# Altium project Testbench__PCB.PrjPcb
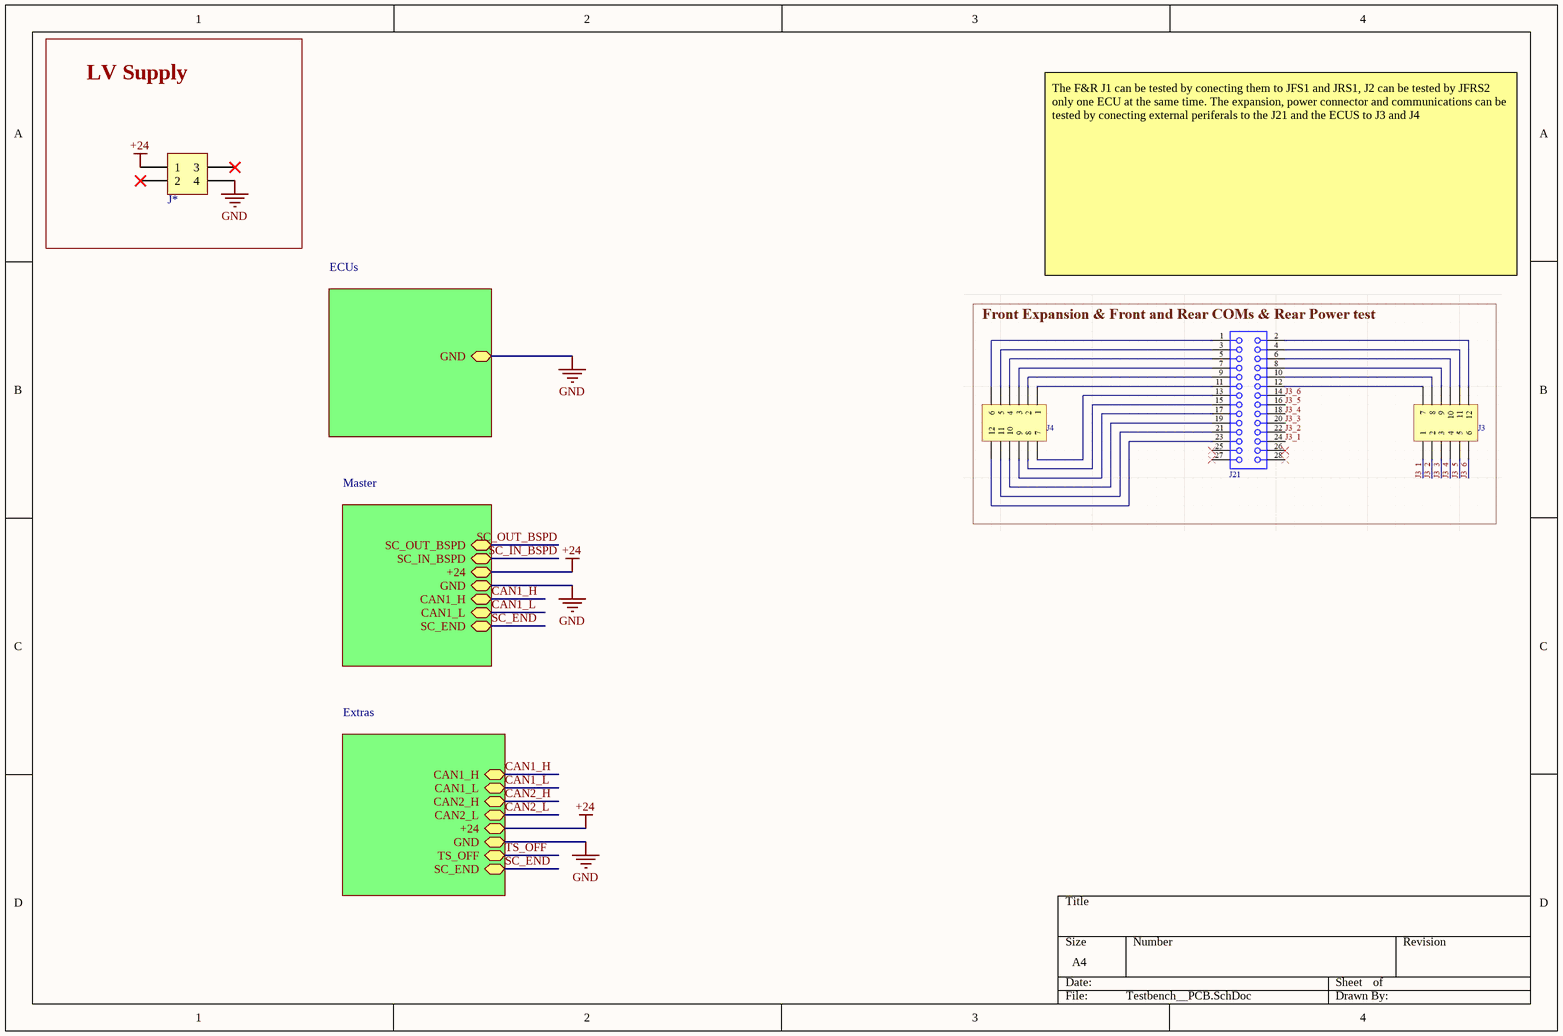
[diagram p0: Testbench__PCB.SchDoc]
5 sheets, 62 parts. Net scope: hierarchical (ports join the sheet entries above them; power ports are global).
Sheets:
  Testbench__PCB.SchDoc
    ECUs = ECUs.SchDoc
    Master = Master.SchDoc
    Extras = Extras.SchDoc
  TS.SchDoc

## Sheet Testbench__PCB.SchDoc
size A4; SheetNumber: 1; SheetTotal: 5

### Parts
(Parts that share a designator on the sheet are numbered #1, #2 ... from top to bottom, then left to right.)
J*#1  430450412  [J_MicroFit_2x2_v]  (value not drawn)

### Blocks framed on the sheet
LV Supply: J*#1

### Sub-sheets
ECUs = ECUs: GND (bidir)
Extras = Extras: CAN1_H (bidir), CAN1_L (bidir), CAN2_H (bidir), CAN2_L (bidir), +24 (bidir), GND (bidir), TS_OFF (bidir), SC_END (bidir)
Master = Master: SC_OUT_BSPD (bidir), SC_IN_BSPD (bidir), +24 (bidir), GND (bidir), CAN1_H (bidir), CAN1_L (bidir), SC_END (bidir)

### Nets
+24: J*#1.1 ; sheet Master/+24, sheet Extras/+24
GND: J*#1.4 ; sheet ECUs/GND, sheet Master/GND, sheet Extras/GND
CAN1_H: sheet Master/CAN1_H, sheet Extras/CAN1_H
CAN1_L: sheet Master/CAN1_L, sheet Extras/CAN1_L
SC_END: sheet Master/SC_END, sheet Extras/SC_END

Not connected (* = marked no-connect by the designer): J*#1 2* 3*

### Notes on the sheet
- The F&R J1 can be tested by conecting them to JFS1 and JRS1, J2 can be tested by JFRS2 only one ECU at the same time. The expansion, power connector and communications can be tested by conecting external periferals to the J21 and the ECUS to J3 and J4

### Library data of the parts
J*#1 = J_MicroFit_2x2: Header 2 Row Vertical Polarizing Peg 4 Pin Tin Plate SMT/Glow Wire Kinked Leads; Manufacturer 1: Molex; Manufacturer Part Number 1: 43045-0412; .Creator: DR; Supplier 1: Arrow Electronics; RoHS: Yes; Category: Headers and Wire Housings; Stock 1: 54122; Pricing 1: 1=1,24720, 10=1,02970, 80=0,85390, 2232=0,63810, 6696=0,59030, 11160=0,55550 (USD); ComponentLink1URL: https://datasheet.ciiva.com/19462/883368-19462265.pdf?src-supplier=Jameco; ComponentLink1Description: https://datasheet.ciiva.com/19462/883368-19462265.pdf?src-supplier=Jameco; ComponentLink2URL: https://datasheet.ciiva.com/5158/0430450412-pcb-headers-142874-5158187.pdf?src-supplier=Mouser; ComponentLink2Description: https://datasheet.ciiva.com/5158/0430450412-pcb-headers-142874-5158187.pdf?src-supplier=Mouser; ComponentLink3URL: https://datasheet.ciiva.com/30095/176640430450412-pcb-headers-30095929.pdf?src-supplier=Onlinecomponents.com; ComponentLink3Description: https://datasheet.ciiva.com/30095/176640430450412-pcb-headers-30095929.pdf?src-supplier=Onlinecomponents.com; ComponentLink4URL: https://datasheet.ciiva.com/11747/0900766b800bd7d2-11747137.pdf?src-supplier=RSComponents; ComponentLink4Description: https://datasheet.ciiva.com/11747/0900766b800bd7d2-11747137.pdf?src-supplier=RSComponents; ComponentLink5URL: https://datasheet.ciiva.com/26916/getdatasheetpartid-253008-26916516.pdf?src-supplier=Verical; ComponentLink5Description: https://datasheet.ciiva.com/26916/getdatasheetpartid-253008-26916516.pdf?src-supplier=Verical; ComponentLink6URL: https://datasheet.ciiva.com/22637/1928349-22637530.pdf?src-supplier=Element14; ComponentLink6Description: https://datasheet.ciiva.com/22637/1928349-22637530.pdf?src-supplier=Element14; ComponentLink7URL: https://datasheet.ciiva.com/9468/0430450412-pcb-headers-9468485.pdf?src-supplier=Avnet; ComponentLink7Description: https://datasheet.ciiva.com/9468/0430450412-pcb-headers-9468485.pdf?src-supplier=Avnet; Supplier Part Number 1: 43045-0412

## Sheet ECUs.SchDoc
size A4; SheetNumber: 2; SheetTotal: 5
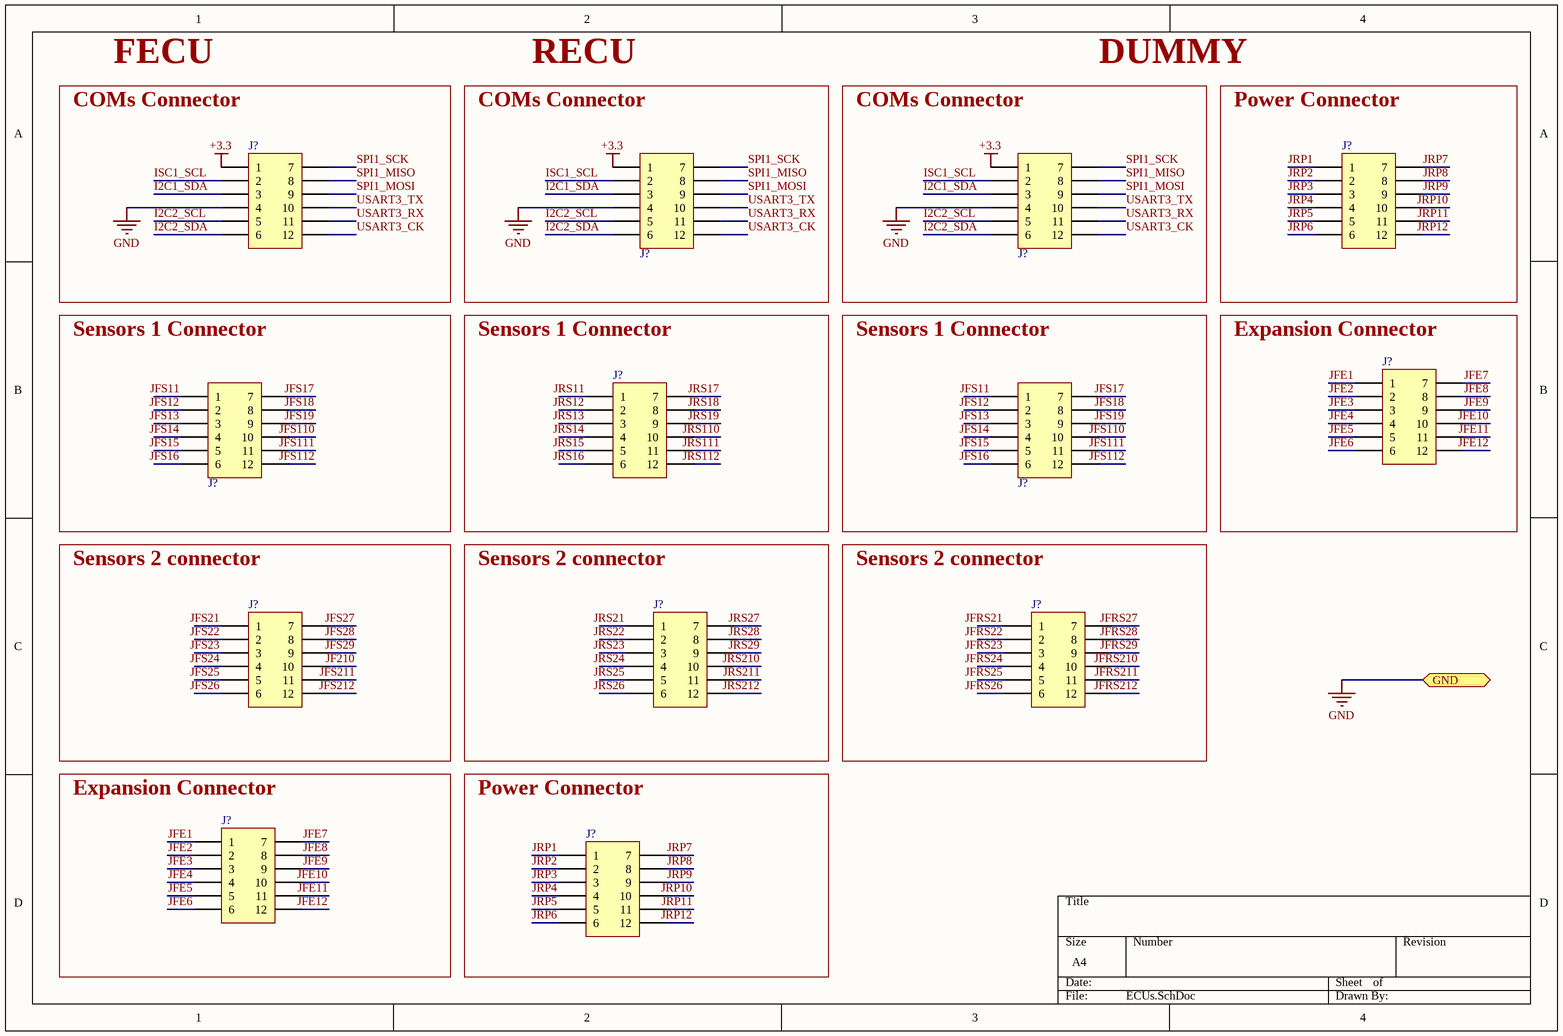
[diagram p1: ECUs.SchDoc]

### Parts
(Parts that share a designator on the sheet are numbered #1, #2 ... from top to bottom, then left to right.)
J?#1  1053101112  [J_NanoFit_2x6_V]  (value not drawn)
J?#2  1053101112  [J_NanoFit_2x6_V]  (value not drawn)
J?#3  1053101112  [J_NanoFit_2x6_V]  (value not drawn)
J?#4  1053101112  [J_NanoFit_2x6_V]  (value not drawn)
J?#5  1053101112  [J_NanoFit_2x6_V]  (value not drawn)
J?#6  1053101112  [J_NanoFit_2x6_V]  (value not drawn)
J?#7  1053101112  [J_NanoFit_2x6_V]  (value not drawn)
J?#8  1053101112  [J_NanoFit_2x6_V]  (value not drawn)
J?#9  1053101112  [J_NanoFit_2x6_V]  (value not drawn)
J?#10  1053101112  [J_NanoFit_2x6_V]  (value not drawn)
J?#11  1053101112  [J_NanoFit_2x6_V]  (value not drawn)
J?#12  1053101112  [J_NanoFit_2x6_V]  (value not drawn)
J?#13  1053101112  [J_NanoFit_2x6_V]  (value not drawn)

### Blocks framed on the sheet
FECU: J?#1
RECU: J?#2
DUMMY: J?#3
Power Connector: J?#4
Sensors 1 Connector: J?#6
Sensors 1 Connector: J?#7
Sensors 1 Connector: J?#8
Expansion Connector: J?#5
Sensors 2 connector: J?#9
Sensors 2 connector: J?#10
Sensors 2 connector: J?#11
Expansion Connector: J?#12
Power Connector: J?#13

### Ports
GND (bidir)

### Nets
+3.3: J?#1.1 J?#2.1 J?#3.1
GND: J?#1.4 J?#2.4 J?#3.4 ; port GND
I2C1_SDA: J?#1.3 J?#2.3 J?#3.3
I2C2_SCL: J?#1.5 J?#2.5 J?#3.5
I2C2_SDA: J?#1.6 J?#2.6 J?#3.6
ISC1_SCL: J?#1.2 J?#2.2 J?#3.2
JF210: J?#9.10
JFE1: J?#5.1 J?#12.1
JFE2: J?#5.2 J?#12.2
JFE3: J?#5.3 J?#12.3
JFE4: J?#5.4 J?#12.4
JFE5: J?#5.5 J?#12.5
JFE6: J?#5.6 J?#12.6
JFE7: J?#5.7 J?#12.7
JFE8: J?#5.8 J?#12.8
JFE9: J?#5.9 J?#12.9
JFE10: J?#5.10 J?#12.10
JFE11: J?#5.11 J?#12.11
JFE12: J?#5.12 J?#12.12
JFRS21: J?#11.1
JFRS22: J?#11.2
JFRS23: J?#11.3
JFRS24: J?#11.4
JFRS25: J?#11.5
JFRS26: J?#11.6
JFRS27: J?#11.7
JFRS28: J?#11.8
JFRS29: J?#11.9
JFRS210: J?#11.10
JFRS211: J?#11.11
JFRS212: J?#11.12
JFS11: J?#6.1 J?#8.1
JFS12: J?#6.2 J?#8.2
JFS13: J?#6.3 J?#8.3
JFS14: J?#6.4 J?#8.4
JFS15: J?#6.5 J?#8.5
JFS16: J?#6.6 J?#8.6
JFS17: J?#6.7 J?#8.7
JFS18: J?#6.8 J?#8.8
JFS19: J?#6.9 J?#8.9
JFS21: J?#9.1
JFS22: J?#9.2
JFS23: J?#9.3
JFS24: J?#9.4
JFS25: J?#9.5
JFS26: J?#9.6
JFS27: J?#9.7
JFS28: J?#9.8
JFS29: J?#9.9
JFS110: J?#6.10 J?#8.10
JFS111: J?#6.11 J?#8.11
JFS112: J?#6.12 J?#8.12
JFS211: J?#9.11
JFS212: J?#9.12
JRP1: J?#4.1 J?#13.1
JRP2: J?#4.2 J?#13.2
JRP3: J?#4.3 J?#13.3
JRP4: J?#4.4 J?#13.4
JRP5: J?#4.5 J?#13.5
JRP6: J?#4.6 J?#13.6
JRP7: J?#4.7 J?#13.7
JRP8: J?#4.8 J?#13.8
JRP9: J?#4.9 J?#13.9
JRP10: J?#4.10 J?#13.10
JRP11: J?#4.11 J?#13.11
JRP12: J?#4.12 J?#13.12
JRS11: J?#7.1
JRS12: J?#7.2
JRS13: J?#7.3
JRS14: J?#7.4
JRS15: J?#7.5
JRS16: J?#7.6
JRS17: J?#7.7
JRS18: J?#7.8
JRS19: J?#7.9
JRS21: J?#10.1
JRS22: J?#10.2
JRS23: J?#10.3
JRS24: J?#10.4
JRS25: J?#10.5
JRS26: J?#10.6
JRS27: J?#10.7
JRS28: J?#10.8
JRS29: J?#10.9
JRS110: J?#7.10
JRS111: J?#7.11
JRS112: J?#7.12
JRS210: J?#10.10
JRS211: J?#10.11
JRS212: J?#10.12
SPI1_MISO: J?#1.8 J?#2.8 J?#3.8
SPI1_MOSI: J?#1.9 J?#2.9 J?#3.9
SPI1_SCK: J?#1.7 J?#2.7 J?#3.7
USART3_CK: J?#1.12 J?#2.12 J?#3.12
USART3_RX: J?#1.11 J?#2.11 J?#3.11
USART3_TX: J?#1.10 J?#2.10 J?#3.10

### Notes on the sheet
- COMs Connector

### Library data of the parts
J?#1-J?#13 = J_NanoFit_2x6_V: Nano-Fit Vertical Header, Through Hole, 2.50mm Pitch, Dual Row, 12 Circuits, with Kinked Pins, Tin (Sn) Plating, Black, Glow-Wire Capable, Tray

## Sheet Master.SchDoc
size A4; SheetNumber: 3; SheetTotal: 5
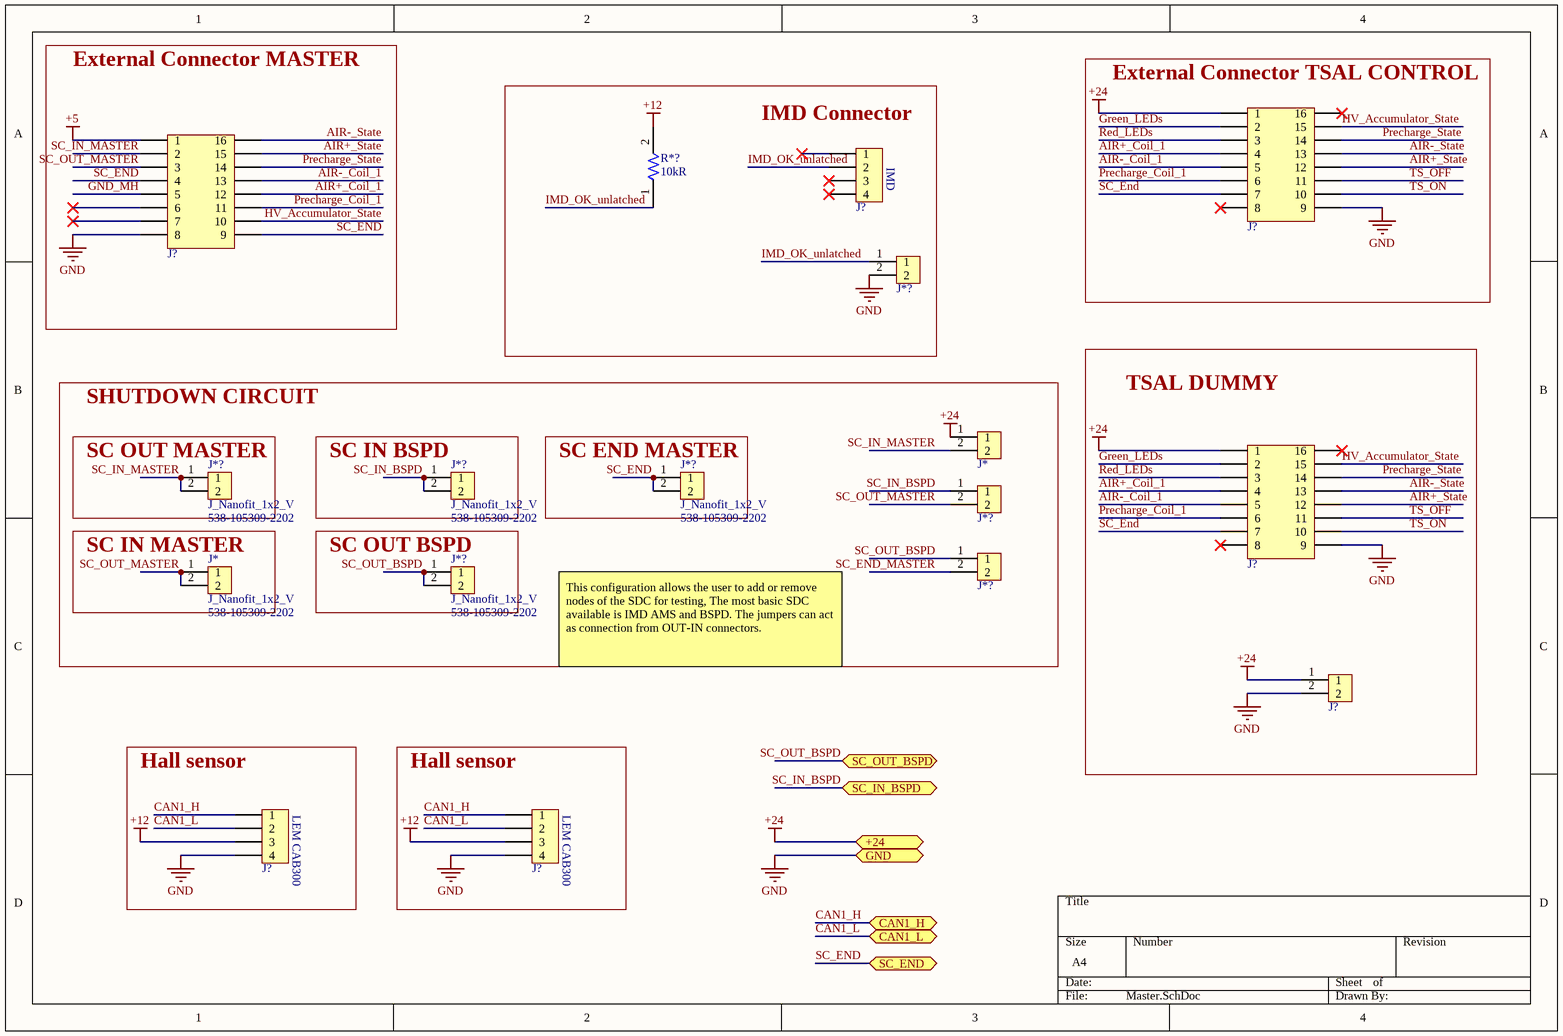
[diagram p2: Master.SchDoc]

### Parts
(Parts that share a designator on the sheet are numbered #1, #2 ... from top to bottom, then left to right.)
J*#2  61300211121  [J_Pinheader_1x2]  (value not drawn)
J*#3  J_Nanofit_1x2_V  Supplier Part Number 1: 538-105309-2202  [J_NanoFit_1X2_V]
J*?#1  61300211121  [J_Pinheader_1x2]  (value not drawn)
J*?#2  J_Nanofit_1x2_V  Supplier Part Number 1: 538-105309-2202  [J_NanoFit_1X2_V]
J*?#3  J_Nanofit_1x2_V  Supplier Part Number 1: 538-105309-2202  [J_NanoFit_1X2_V]
J*?#4  J_Nanofit_1x2_V  Supplier Part Number 1: 538-105309-2202  [J_NanoFit_1X2_V]
J*?#5  61300211121  [J_Pinheader_1x2]  (value not drawn)
J*?#6  61300211121  [J_Pinheader_1x2]  (value not drawn)
J*?#7  J_Nanofit_1x2_V  Supplier Part Number 1: 538-105309-2202  [J_NanoFit_1X2_V]
J?#14  1053101116  [J_NanoFit_2x8_V]  (value not drawn)
J?#15  1053101116  [J_NanoFit_2x8_V]  (value not drawn)
J?#16  1053091204  [J_NanoFit_1x4_V]  (value not drawn)
J?#17  1053101116  [J_NanoFit_2x8_V]  (value not drawn)
J?#18  436500215  [J_MicroFit_2x1]  (value not drawn)
J?#19  1053091204  [J_NanoFit_1x4_V - duplicate]  (value not drawn)
J?#20  1053091204  [J_NanoFit_1x4_V - duplicate]  (value not drawn)
R*?  Resistance: 10kR  [R0805FTK]  (hidden comment: CR0805-JW-103ELF)

### Blocks framed on the sheet
External Connector MASTER: J?#15
IMD Connector: J*?#1 J?#16 R*?
External Connector TSAL CONTROL: J?#14
TSAL DUMMY: J?#17 J?#18
SHUTDOWN CIRCUIT: J*#2 J*?#5 J*?#6
SC OUT MASTER: J*?#2
SC IN BSPD: J*?#3
SC END MASTER: J*?#4
SC IN MASTER: J*#3
SC OUT BSPD: J*?#7
Hall sensor: J?#19
Hall sensor: J?#20

### Ports
+24 (bidir), CAN1_H (bidir), CAN1_L (bidir), GND (bidir), SC_END (bidir), SC_IN_BSPD (bidir), SC_OUT_BSPD (bidir)

### Nets
+5: J?#15.1
+12: J?#19.3 J?#20.3 R*?.2
+24: J*#2.1 J?#14.1 J?#17.1 J?#18.1 ; port +24
GND: J*?#1.2 J?#14.9 J?#15.8 J?#17.9 J?#18.2 J?#19.4 J?#20.4 ; port GND
AIR+_Coil_1: J?#14.4 J?#15.12 J?#17.4
AIR+_State: J?#14.12 J?#15.15 J?#17.12
AIR-_Coil_1: J?#14.5 J?#15.13 J?#17.5
AIR-_State: J?#14.13 J?#15.16 J?#17.13
CAN1_H: J?#19.1 J?#20.1 ; port CAN1_H
CAN1_L: J?#19.2 J?#20.2 ; port CAN1_L
GND_MH: J?#15.5
Green_LEDs: J?#14.2 J?#17.2
HV_Accumulator_State: J?#14.15 J?#15.10 J?#17.15
IMD_OK_unlatched: J*?#1.1 J?#16.2 R*?.1
Precharge_Coil_1: J?#14.6 J?#15.11 J?#17.6
Precharge_State: J?#14.14 J?#15.14 J?#17.14
Red_LEDs: J?#14.3 J?#17.3
SC_END: J*?#4.1 J*?#4.2 J?#14.7 J?#15.4 J?#15.9 J?#17.7 ; port SC_END
SC_END_MASTER: J*?#6.2
SC_IN_BSPD: J*?#3.1 J*?#3.2 J*?#5.1 ; port SC_IN_BSPD
SC_IN_MASTER: J*#2.2 J*?#2.1 J*?#2.2 J?#15.2
SC_OUT_BSPD: J*?#6.1 J*?#7.1 J*?#7.2 ; port SC_OUT_BSPD
SC_OUT_MASTER: J*#3.1 J*#3.2 J*?#5.2 J?#15.3
TS_OFF: J?#14.11 J?#17.11
TS_ON: J?#14.10 J?#17.10

Not connected (* = marked no-connect by the designer): J?#14 8* 16*; J?#15 6* 7*; J?#16 1* 3* 4*; J?#17 8* 16*

### Notes on the sheet
- (near J?#16) IMD
- This configuration allows the user to add or remove nodes of the SDC for testing, The most basic SDC available is IMD AMS and BSPD. The jumpers can act as connection from OUT-IN connectors.
- (near J?#19) LEM CAB300
- (near J?#20) LEM CAB300

### Library data of the parts
J*#2 J*?#1 J*?#5 J*?#6 = J_Jumper: CONN HEADER 2 POS 2.54; Manufacturer: Molex; Temperature rating: -40° to +105°C; Category type: PCB-PCB; Product name: Pin Header; Maximum current: 3 A; Maximum voltage: 250 V AC; Connections: 1x2; Current Rating: 3A; Voltage Rating: 250V; Number of Positions: 2; Gender: Male; Connector Type: Male Pin; Pitch: 0.1inch; .Creator: GP; Category: Connector; ComponentLink1Description: Datasheet; ComponentLink1URL: https://www.we-online.com/catalog/datasheet/61300211121.pdf; ComponentLink2Description: Where buy it; ComponentLink2URL: https://www.we-online.com/catalog/en/PHD_2_54_THT_PIN_HEADER_6130XX11121?sq=61300211121&sp=https%3A%2F%2Fwww.we-online.com%2Fweb%2Fen%2Fwuerth_elektronik%2Fsearchpage.php%3Fsearch%3D61300211121#61300211121; Manufacturer part number: 61300211121; Supplier: Würth Elektronik; RoHS: *; Application: Shortcircuit; Flammability: 94V-0; Orientation: Vertical; Mount: Through hole; Supplier 1: RSComponents; Stock 1: 1855; Pricing 1: 5=0,14100, 50=0,09700, 100=0,07800, 200=0,07300, 500=0,06800 (USD); Contact Plating: Gold; Housing Material: PBT; Contact Material: Copper Alloy,Copper; Color: Black; Min Operating Temperature: -40°C; Max Operating Temperature: 125°C; Number of Rows: 1; Contact Gender: Male; Packaging: Bulk; Termination: Through Hole; Number of Contacts: 2; Contact Mating Length: 0.236inch; REACH SVHC: Unknown; Lead Free: Lead Free; ComponentLink3URL: https://datasheet.ciiva.com/13619/6130xx11121-48870-13619345.pdf?src-supplier=Mouser; ComponentLink3Description: https://datasheet.ciiva.com/13619/6130xx11121-48870-13619345.pdf?src-supplier=Mouser; Supplier Part Number 1: 8281581
J*#3 J*?#2-J*?#4 J*?#7 = J_Nanofit_1x2_V: Nano-Fit Vertical Header, Through Hole, 2.50mm Pitch, Single Row, 2 Circuits, with Kinked Pins, Tin (Sn) Plating,...; Manufacturer: Molex; Manufacturer Part Number: 1053092202; Supplier 1: Mouser; RoHS: No; Stock 1: 6299; Pricing 1: 1=1,09, 10=0,839, 50=0,839, 100=0,686, 1000=0,571, 10000=0,507 (USD)
J?#14 J?#15 J?#17 = J_NanoFit_2x8_V: Nano-Fit Vertical Header Through Hole 2.50mm Pitch Dual Row 16 Circuits with Kinked Pins Tin (Sn) Plating Black; Manufacturer 1: Molex; Manufacturer Part Number 1: 105310-1116; Connector Type: Header,Male Pin; Number of Positions: 16; .Creator: AC; Supplier 1: Digi-Key; RoHS: No; Category: Headers and Wire Housings; Stock 1: 84; Pricing 1: 1=3,21000, 10=2,82400, 84=2,24619, 1008=1,86110, 4956=1,66858 (USD); Mount: Through Hole; Contact Plating: Tin; Contact Material: Brass; Contact Shape: Square; Insulation Material: Polymer; Insulation Color: Black; Min Operating Temperature: -40°C; Max Operating Temperature: 105°C; Fastening Type: Latch; Packaging: Tray; Number of Rows: 2; Termination: Kinked Pin; ComponentLink1URL: https://www.molex.com/pdm_docs/sd/1053101210_sd.pdf?src-supplier=Digi-Key; ComponentLink1Description: https://www.molex.com/pdm_docs/sd/1053101210_sd.pdf?src-supplier=Digi-Key; Supplier Part Number 1: WM16885-ND; ComponentLink2Description: Molex; ComponentLink2URL: https://www.molex.com/molex/products/part-detail/pcb_headers/1053101116
J?#16 J?#19 J?#20 = J_NanoFit_1x4_V: Nano-Fit Vertical Header Through Hole 2.50mm Pitch Single Row 4 Circuits with Kinked Pins 0.38; Manufacturer 1: Molex; Manufacturer Part Number 1: 105309-1204; .Creator: DO; Supplier 1: Arrow Electronics; RoHS: No; Category: Headers and Wire Housings; Stock 1: 709; Pricing 1: 1=1,37050, 10=1,11700, 100=0,95270, 500=0,86980, 1000=0,74060, 2500=0,71930, 5000=0,68450, 10000=0,66860 (USD); ComponentLink1URL: http://farnell.com//datasheets/2221349.pdf?src-supplier=Farnell; ComponentLink1Description: http://farnell.com//datasheets/2221349.pdf?src-supplier=Farnell; ComponentLink2URL: http://www.farnell.com/datasheets/2221349.pdf?src-supplier=Newark; ComponentLink2Description: http://www.farnell.com/datasheets/2221349.pdf?src-supplier=Newark; ComponentLink3URL: http://www.literature.molex.com/SQLImages/kelmscott/Molex/PDF_Images/987651-1223.PDF?src-supplier=Digi-Key; ComponentLink3Description: http://www.literature.molex.com/SQLImages/kelmscott/Molex/PDF_Images/987651-1223.PDF?src-supplier=Digi-Key; ComponentLink4URL: http://www.farnell.com/datasheets/2059602.pdf?src-supplier=Element14; ComponentLink4Description: http://www.farnell.com/datasheets/2059602.pdf?src-supplier=Element14; Supplier Part Number 1: 105309-1204
J?#18 = J_MicroFit_2x1: Header 1 Row Vertical Polarizing Peg 2 Pin SMT/Glow Wire Compatible Tin Plate; Manufacturer 1: Molex; Manufacturer Part Number 1: 43650-0215; Supplier 1: Arrow Electronics; RoHS: Yes; Category: Headers and Wire Housings; Stock 1: 11086; Pricing 1: 1=0,87800, 10=0,74400, 80=0,63070, 3264=0,47000, 6528=0,45100, 13056=0,41760 (USD); ComponentLink1URL: https://datasheet.ciiva.com/19462/884109-19462034.pdf?src-supplier=Jameco; ComponentLink1Description: https://datasheet.ciiva.com/19462/884109-19462034.pdf?src-supplier=Jameco; ComponentLink2URL: https://datasheet.ciiva.com/5157/0436500215-pcb-headers-148687-5157608.pdf?src-supplier=Mouser; ComponentLink2Description: https://datasheet.ciiva.com/5157/0436500215-pcb-headers-148687-5157608.pdf?src-supplier=Mouser; ComponentLink3URL: https://datasheet.ciiva.com/16085/0436500215-pcb-headers-16085668.pdf?src-supplier=Onlinecomponents.com; ComponentLink3Description: https://datasheet.ciiva.com/16085/0436500215-pcb-headers-16085668.pdf?src-supplier=Onlinecomponents.com; ComponentLink4URL: https://datasheet.ciiva.com/11748/0900766b80307ce2-11748388.pdf?src-supplier=RSComponents; ComponentLink4Description: https://datasheet.ciiva.com/11748/0900766b80307ce2-11748388.pdf?src-supplier=RSComponents; ComponentLink5URL: https://datasheet.ciiva.com/9432/0436500215-pcb-headers-9432850.pdf?src-supplier=Avnet; ComponentLink5Description: https://datasheet.ciiva.com/9432/0436500215-pcb-headers-9432850.pdf?src-supplier=Avnet; ComponentLink6URL: https://datasheet.ciiva.com/7920/1889390-7920892.pdf?src-supplier=Element14; ComponentLink6Description: https://datasheet.ciiva.com/7920/1889390-7920892.pdf?src-supplier=Element14; Supplier Part Number 1: 43650-0215
R*? = R10k-0805FTK: BOURNS         CR0805-JW-103ELF            Surface Mount Chip Resistor, Thick Film, CR Series, 10 kohm, 125 mW,  5%, 150 V; Temperature Coefficient: 200ppm/°C; Power Rating: 125mW; Voltage Rating: 150V; Voltage Rating (DC): 100V; .Creator: DR; Supplier 1: Arrow Electronics; Manufacturer 1: Bourns; Manufacturer Part Number 1: CR0805-JW-103ELF; RoHS: Yes; Category: Chip SMD Resistors; Stock 1: 57566; Pricing 1: 1=0,05790, 10=0,01540, 25=0,01340, 100=0,00340 (USD); Mount: Surface Mount; Case/Package: 0805; Number of Pins: 2; Contact Plating: Tin; Case Code (Metric): 2012; Case Code (Imperial): 0805; Min Operating Temperature: -55°C; Max Operating Temperature: 155°C; Tolerance: 5%; Resistor Type: Thick Film; Package Quantity: 1; Packaging: Tape and Reel; Number of Terminations: 2; Termination: SMD/SMT; Max Power Dissipation: 125mW; Features: Moisture Resistant; Series: CR0805; Construction: Rectangular; Resistance Tolerance: 5%; Technology: THICK FILM; Length: 2mm; Width: 1.25mm; Height: 0.5mm; Depth: 1.25mm; Thickness: 508um; Radiation Hardening: No; REACH SVHC: No SVHC; Military Standard: Not; RoHS Compliant: Yes; ComponentLink1URL: https://datasheet.ciiva.com/11821/0900766b80fcdb72-11821135.pdf?src-supplier=RSComponents; ComponentLink1Description: https://datasheet.ciiva.com/11821/0900766b80fcdb72-11821135.pdf?src-supplier=RSComponents; ComponentLink2URL: https://datasheet.ciiva.com/9122/chpreztr-9122374.pdf?src-supplier=Avnet; ComponentLink2Description: https://datasheet.ciiva.com/9122/chpreztr-9122374.pdf?src-supplier=Avnet; ComponentLink3URL: https://datasheet.ciiva.com/22693/1902866-22693254.pdf?src-supplier=Element14; ComponentLink3Description: https://datasheet.ciiva.com/22693/1902866-22693254.pdf?src-supplier=Element14; ComponentLink4URL: https://datasheet.ciiva.com/7986/691949-7986187.pdf?src-supplier=Element14; ComponentLink4Description: https://datasheet.ciiva.com/7986/691949-7986187.pdf?src-supplier=Element14; ComponentLink5URL: https://datasheet.ciiva.com/30065/159chpreztr-30065976.pdf?src-supplier=Onlinecomponents.com; ComponentLink5Description: https://datasheet.ciiva.com/30065/159chpreztr-30065976.pdf?src-supplier=Onlinecomponents.com; ComponentLink6URL: https://datasheet.ciiva.com/16783/70154685-16783482.pdf?src-supplier=Allied+Electronics; ComponentLink6Description: https://datasheet.ciiva.com/16783/70154685-16783482.pdf?src-supplier=Allied+Electronics; ComponentLink7URL: https://datasheet.ciiva.com/5548/chpreztr-5548491.pdf?src-supplier=Mouser; ComponentLink7Description: https://datasheet.ciiva.com/5548/chpreztr-5548491.pdf?src-supplier=Mouser; ComponentLink8URL: https://datasheet.ciiva.com/6559/chpreztr-6559900.pdf?src-supplier=Digi-Key; ComponentLink8Description: https://datasheet.ciiva.com/6559/chpreztr-6559900.pdf?src-supplier=Digi-Key; ComponentLink9URL: https://datasheet.ciiva.com/6559/chpreztr-6559901.pdf?src-supplier=Digi-Key; ComponentLink9Description: https://datasheet.ciiva.com/6559/chpreztr-6559901.pdf?src-supplier=Digi-Key; ComponentLink10URL: https://datasheet.ciiva.com/7985/1856384-7985869.pdf?src-supplier=Element14; ComponentLink10Description: https://datasheet.ciiva.com/7985/1856384-7985869.pdf?src-supplier=Element14; ComponentLink11URL: https://datasheet.ciiva.com/48692/001055517-da-01-en-smd-wid-cr0805-jw-103elf-10k-ohm-1-8w-48692118.pdf?src-supplier=Conrad; ComponentLink11Description: https://datasheet.ciiva.com/48692/001055517-da-01-en-smd-wid-cr0805-jw-103elf-10k-ohm-1-8w-48692118.pdf?src-supplier=Conrad; Supplier Part Number 1: CR0805-JW-103ELF

## Sheet Extras.SchDoc
size A4; SheetNumber: 4; SheetTotal: 5
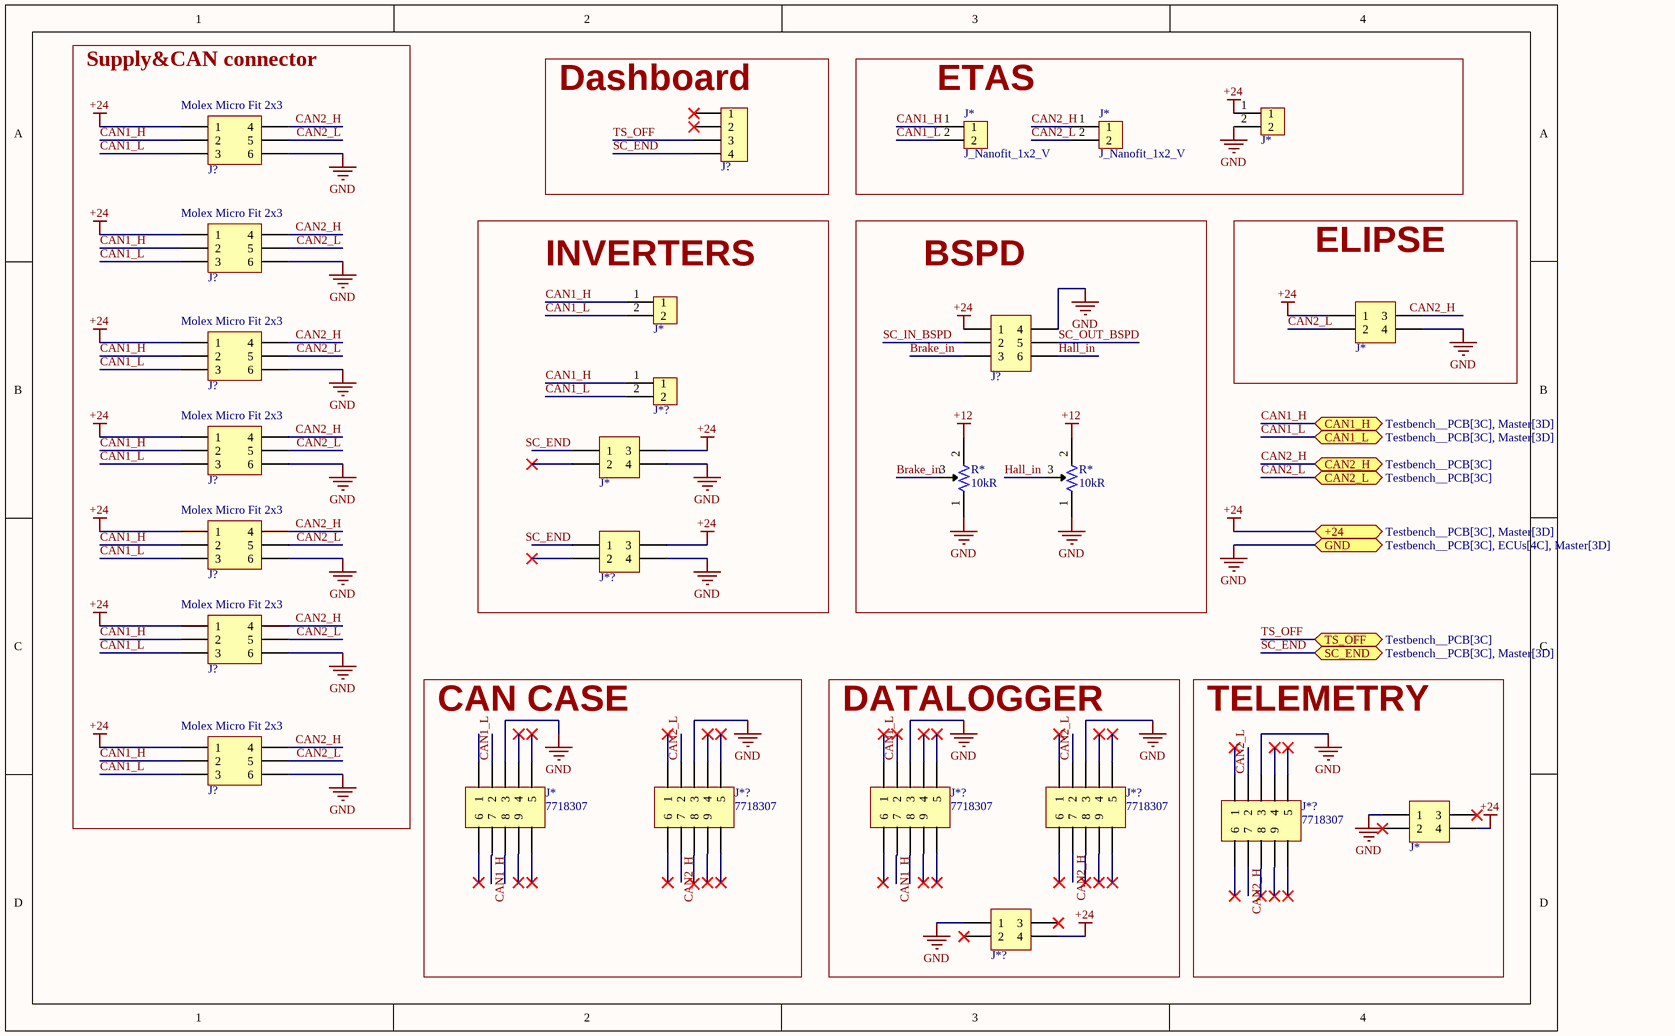
[diagram p3: Extras.SchDoc]

### Parts
(Parts that share a designator on the sheet are numbered #1, #2 ... from top to bottom, then left to right.)
J*#4  436500215  [J_MicroFit_2x1]  (value not drawn)
J*#5  J_Nanofit_1x2_V  [J_NanoFit_1X2_V]
J*#6  J_Nanofit_1x2_V  [J_NanoFit_1X2_V]
J*#7  436500215  [J_MicroFit_2x1]  (value not drawn)
J*#8  J_NanoFit_2x2  [J_NanoFit_2x2_v]  (value not drawn)
J*#9  J_NanoFit_2x2  [J_NanoFit_2x2_v]  (value not drawn)
J*#10  Supplier Part Number 1: 7718307  [J_VGA_CONNECTOR]  (hidden comment: 618009231221)
J*#11  J_NanoFit_2x2  [J_NanoFit_2x2_v]  (value not drawn)
J*?#8  436500215  [J_MicroFit_2x1]  (value not drawn)
J*?#9  J_NanoFit_2x2  [J_NanoFit_2x2_v]  (value not drawn)
J*?#10  Supplier Part Number 1: 7718307  [J_VGA_CONNECTOR]  (hidden comment: 618009231221)
J*?#11  Supplier Part Number 1: 7718307  [J_VGA_CONNECTOR]  (hidden comment: 618009231221)
J*?#12  Supplier Part Number 1: 7718307  [J_VGA_CONNECTOR]  (hidden comment: 618009231221)
J*?#13  Supplier Part Number 1: 7718307  [J_VGA_CONNECTOR]  (hidden comment: 618009231221)
J*?#14  J_NanoFit_2x2  [J_NanoFit_2x2_v]  (value not drawn)
J?#21  436500400  [J_MicroFit_1x4]  (value not drawn)
J?#22  Molex Micro Fit 2x3  [J_MicroFit_2x3_V]
J?#23  Molex Micro Fit 2x3  [J_MicroFit_2x3_V]
J?#24  J_NanoFit_2x3  [J_NanoFit_2x3]  (value not drawn)
J?#25  Molex Micro Fit 2x3  [J_MicroFit_2x3_V]
J?#26  Molex Micro Fit 2x3  [J_MicroFit_2x3_V]
J?#27  Molex Micro Fit 2x3  [J_MicroFit_2x3_V]
J?#28  Molex Micro Fit 2x3  [J_MicroFit_2x3_V]
J?#29  Molex Micro Fit 2x3  [J_MicroFit_2x3_V]
R*#1  Resistance: 10kR  [R10k-VTR]  (hidden comment: 3296W-1-103LF)
R*#2  Resistance: 10kR  [R10k-VTR]  (hidden comment: 3296W-1-103LF)

### Blocks framed on the sheet
Supply&CAN connector: J?#22 J?#23 J?#25-J?#29
Dashboard: J?#21
ETAS: J*#4-J*#6
INVERTERS: J*#7 J*#9 J*?#8 J*?#9
BSPD: J?#24 R*#1 R*#2
ELIPSE: J*#8
CAN CASE: J*#10 J*?#10
DATALOGGER: J*?#11 J*?#12 J*?#14
TELEMETRY: J*#11 J*?#13

### Ports
+24 (bidir, see Testbench__PCB[3C], Master[3D]), CAN1_H (bidir, see Testbench__PCB[3C], Master[3D]), CAN1_L (bidir, see Testbench__PCB[3C], Master[3D]), CAN2_H (bidir, see Testbench__PCB[3C]), CAN2_L (bidir, see Testbench__PCB[3C]), GND (bidir, see Testbench__PCB[3C], ECUs[4C], Master[3D]), SC_END (bidir, see Testbench__PCB[3C], Master[3D]), TS_OFF (bidir, see Testbench__PCB[3C])

### Nets
+12: R*#1.2 R*#2.2
+24: J*#4.1 J*#8.1 J*#9.3 J*#11.4 J*?#9.3 J*?#14.4 J?#22.1 J?#23.1 J?#24.1 J?#25.1 J?#26.1 J?#27.1 J?#28.1 J?#29.1 ; port +24
GND: J*#4.2 J*#8.4 J*#9.4 J*#10.3 J*#11.1 J*?#9.4 J*?#10.3 J*?#11.3 J*?#12.3 J*?#13.3 J*?#14.1 J?#22.6 J?#23.6 J?#24.4 J?#25.6 J?#26.6 J?#27.6 J?#28.6 J?#29.6 R*#1.1 R*#2.1 ; port GND
Brake_in: J?#24.3 R*#1.3
CAN1_H: J*#5.1 J*#7.1 J*#10.7 J*?#8.1 J*?#11.7 J?#22.2 J?#23.2 J?#25.2 J?#26.2 J?#27.2 J?#28.2 J?#29.2 ; port CAN1_H
CAN1_L: J*#5.2 J*#7.2 J*#10.2 J*?#8.2 J*?#11.2 J?#22.3 J?#23.3 J?#25.3 J?#26.3 J?#27.3 J?#28.3 J?#29.3 ; port CAN1_L
CAN2_H: J*#6.1 J*?#12.7 J*?#13.7 J?#22.4 J?#23.4 J?#25.4 J?#26.4 J?#27.4 J?#28.4 J?#29.4 ; port CAN2_H
CAN2_L: J*#6.2 J*#8.2 J*?#10.2 J*?#12.2 J*?#13.2 J?#22.5 J?#23.5 J?#25.5 J?#26.5 J?#27.5 J?#28.5 J?#29.5 ; port CAN2_L
Hall_in: J?#24.6 R*#2.3
SC_END: J*#9.1 J*?#9.1 J?#21.4 ; port SC_END
SC_IN_BSPD: J?#24.2
SC_OUT_BSPD: J?#24.5
TS_OFF: J?#21.3 ; port TS_OFF

Not connected (* = marked no-connect by the designer): J*#8 3; J*#9 2*; J*#10 1 4* 5* 6* 8 9* SHIELD*; J*#11 2* 3*; J*?#9 2*; J*?#10 1* 4* 5* 6* 7 8* 9* SHIELD*; J*?#11 1* 4* 5* 6* 8 9* SHIELD*; J*?#12 1* 4* 5* 6* 8* 9* SHIELD*; J*?#13 1* 4* 5* 6* 8* 9* SHIELD*; J*?#14 2* 3*; J?#21 1* 2*

### Notes on the sheet
- Labels drawn without touching a wire or pin: CAN2_H

### Library data of the parts
J*#4 J*#7 J*?#8 = J_MicroFit_2x1: as J?#18 on sheet Master; Supplier 1: Arrow Electronics; RoHS: Yes; Category: Headers and Wire Housings; Stock 1: 11086; Pricing 1: 1=0,87800, 10=0,74400, 80=0,63070, 3264=0,47000, 6528=0,45100, 13056=0,41760 (USD); ComponentLink1URL: https://datasheet.ciiva.com/19462/884109-19462034.pdf?src-supplier=Jameco; ComponentLink1Description: https://datasheet.ciiva.com/19462/884109-19462034.pdf?src-supplier=Jameco; ComponentLink2URL: https://datasheet.ciiva.com/5157/0436500215-pcb-headers-148687-5157608.pdf?src-supplier=Mouser; ComponentLink2Description: https://datasheet.ciiva.com/5157/0436500215-pcb-headers-148687-5157608.pdf?src-supplier=Mouser; ComponentLink3URL: https://datasheet.ciiva.com/16085/0436500215-pcb-headers-16085668.pdf?src-supplier=Onlinecomponents.com; ComponentLink3Description: https://datasheet.ciiva.com/16085/0436500215-pcb-headers-16085668.pdf?src-supplier=Onlinecomponents.com; ComponentLink4URL: https://datasheet.ciiva.com/11748/0900766b80307ce2-11748388.pdf?src-supplier=RSComponents; ComponentLink4Description: https://datasheet.ciiva.com/11748/0900766b80307ce2-11748388.pdf?src-supplier=RSComponents; ComponentLink5URL: https://datasheet.ciiva.com/9432/0436500215-pcb-headers-9432850.pdf?src-supplier=Avnet; ComponentLink5Description: https://datasheet.ciiva.com/9432/0436500215-pcb-headers-9432850.pdf?src-supplier=Avnet; ComponentLink6URL: https://datasheet.ciiva.com/7920/1889390-7920892.pdf?src-supplier=Element14; ComponentLink6Description: https://datasheet.ciiva.com/7920/1889390-7920892.pdf?src-supplier=Element14; Supplier Part Number 1: 43650-0215
J*#5 J*#6 = J_Nanofit_1x2_V: as J*#3 on sheet Master; Supplier 1: Mouser; RoHS: No; Stock 1: 6299; Pricing 1: 1=1,09, 10=0,839, 50=0,839, 100=0,686, 1000=0,571, 10000=0,507 (USD); Supplier Part Number 1: 538-105309-2202
J*#8 J*#9 J*#11 J*?#9 J*?#14 = J_NanoFit_2x2: Conn Nano-Fit Power HDR 4 POS 2.5mm Solder ST Through Hole 4 Terminal Single Port Tray; Manufacturer 1: Molex; Manufacturer Part Number 1: 1053101104; Supplier 1: Farnell; RoHS: Yes; Category: Uncategorized; Stock 1: 255; Pricing 1: 1=1,43000, 10=1,18000, 50=0,74900, 100=0,72900, 500=0,71400, 1000=0,70700 (EUR); ComponentLink1URL: https://www.molex.com/pdm_docs/ps/PS-105300-100-001.pdf?src-supplier=Digi-Key; ComponentLink1Description: https://www.molex.com/pdm_docs/ps/PS-105300-100-001.pdf?src-supplier=Digi-Key; Supplier Part Number 1: 2820681
J*#10 J*?#10-J*?#13 = J_VGA_CONNECTOR: 9 Way Right Angle Through Hole PCB D-sub Connector Plug; 2.77mm; 2.84mm Pitch; Manufacturer: Wurth Electronics; Gender: Male; Current Rating: 3A; Voltage Rating: 125V; Number of Contacts: 9; Supplier 1: Rs; Manufacturer Part Number: 618009231221; RoHS: Yes; Category: D-Sub Connectors; Stock 1: 136; Pricing 1: 1=2,78, 10=2,59, 50=2,45, 100=2,3 (EUR); Mounting Technology: Through Hole; Contact Material: Copper Alloy; Contact Plating: Gold; Housing Material: Steel; Min Operating Temperature: -40°C; Max Operating Temperature: 85°C; Number of Rows: 2; Termination: SMD/SMT; Orientation: Right Angle; Series: 618; Length: 30.8mm; Width: 12.5mm; Depth: 18.5mm; Pitch: 2.84mm; RoHS Compliant: Yes; Reach SVHC Compliant: Unknown; ComponentLink1URL: https://datasheet.ciiva.com/12669/6180xx231221-12669204.pdf?src-supplier=Mouser; ComponentLink1Description: https://datasheet.ciiva.com/12669/6180xx231221-12669204.pdf?src-supplier=Mouser; ComponentLink2URL: https://datasheet.ciiva.com/25605/0900766b81191766-25605476.pdf?src-supplier=Rs; ComponentLink2Description: https://datasheet.ciiva.com/25605/0900766b81191766-25605476.pdf?src-supplier=Rs; ComponentLink3URL: https://datasheet.ciiva.com/1426/1442191-1426429.pdf?src-supplier=Element14; ComponentLink3Description: https://datasheet.ciiva.com/1426/1442191-1426429.pdf?src-supplier=Element14
J?#21 = J_MicroFit_1x4: Connector Wire to Board Header 4 Position 3mm Solder Right Angle Thru-Hole Tray; Manufacturer 1: Molex; Manufacturer Part Number 1: 43650-0400; Current Rating: 5A; Voltage Rating: 600V; Contact Resistance: 10mR; Connector Type: Plug; Number of Positions: 4; Gender: Male; Voltage Rating (DC): 250V; Glow Wire Compliant: Compliant; Supplier 1: Farnell; RoHS: Yes; Category: Headers and Wire Housings; Stock 1: 4623; Pricing 1: 1=1,24000, 10=1,22000, 50=1,19000, 100=1,17000, 500=1,14000, 1000=1,12000 (EUR); Mount: Through Hole,Cable; Contact Material: Brass,Copper Alloy; Contact Plating: Tin; Color: Black; Housing Color: Black; Housing Material: Thermoplastic; Min Operating Temperature: -40°C; Max Operating Temperature: 105°C; Termination: Solder; Orientation: Right Angle; Number of Rows: 1; Packaging: Tray; Package Quantity: 2380; Number of Contacts: 4; Max Voltage Rating (AC): 600V; Number of Circuits: 4; Series: 43650; Length: 14.86mm; Height: 4.5mm; Pitch: 3mm; Depth: 3.6mm; Radiation Hardening: No; Halogen Free: Low Halogen; Lead Free: Contains Lead; Flammability Rating: UL94 V-0; RoHS Compliant: Yes; ComponentLink1URL: https://datasheet.ciiva.com/19462/884184-19462234.pdf?src-supplier=Jameco; ComponentLink1Description: https://datasheet.ciiva.com/19462/884184-19462234.pdf?src-supplier=Jameco; ComponentLink2URL: https://datasheet.ciiva.com/5151/0436500400-pcb-headers-148663-5151881.pdf?src-supplier=Mouser; ComponentLink2Description: https://datasheet.ciiva.com/5151/0436500400-pcb-headers-148663-5151881.pdf?src-supplier=Mouser; ComponentLink3URL: https://datasheet.ciiva.com/16085/0436500400-pcb-headers-16085752.pdf?src-supplier=Onlinecomponents.com; ComponentLink3Description: https://datasheet.ciiva.com/16085/0436500400-pcb-headers-16085752.pdf?src-supplier=Onlinecomponents.com; ComponentLink4URL: https://datasheet.ciiva.com/11748/0900766b80d6135b-11748178.pdf?src-supplier=RSComponents; ComponentLink4Description: https://datasheet.ciiva.com/11748/0900766b80d6135b-11748178.pdf?src-supplier=RSComponents; ComponentLink5URL: https://datasheet.ciiva.com/30221/142510436500400-pcb-headers-30221164.pdf?src-supplier=Onlinecomponents.com; ComponentLink5Description: https://datasheet.ciiva.com/30221/142510436500400-pcb-headers-30221164.pdf?src-supplier=Onlinecomponents.com; ComponentLink6URL: https://datasheet.ciiva.com/17080/70266896-17080471.pdf?src-supplier=Allied+Electronics; ComponentLink6Description: https://datasheet.ciiva.com/17080/70266896-17080471.pdf?src-supplier=Allied+Electronics; ComponentLink7URL: https://datasheet.ciiva.com/7094/1946229-7094763.pdf?src-supplier=Newark; ComponentLink7Description: https://datasheet.ciiva.com/7094/1946229-7094763.pdf?src-supplier=Newark; ComponentLink8URL: https://datasheet.ciiva.com/9449/0436500400-pcb-headers-9449446.pdf?src-supplier=Avnet; ComponentLink8Description: https://datasheet.ciiva.com/9449/0436500400-pcb-headers-9449446.pdf?src-supplier=Avnet; Supplier Part Number 1: 1012232
J?#22 J?#23 J?#25-J?#29 = J_MicroFit_2x3_V: Micro fit Header, 2 Row, Vertical, Polarizing Peg, 6 Pin, Tin Plate, SMT/Glow Wire, Kinked Leads; Manufacturer Part Number: 43045-0612; .Creator: DO; ComponentLink8Description: Where buy it; ComponentLink8URL: https://www.molex.com/molex/products/part-detail/pcb_headers/0430450612; Supplier 1: RSComponents; Manufacturer: Molex; RoHS: Yes; Category: Headers and Wire Housings; Stock 1: 2635; Pricing 1: 5=1,45500, 100=1,26700, 375=1,08900, 1500=0,90900, 3000=0,72900 (USD); ComponentLink1URL: https://www.molex.com/pdm_docs/sd/430450612_sd.pdf; ComponentLink1Description: Datasheet; ComponentLink2URL: https://datasheet.ciiva.com/11748/0900766b800bd7d2-11748707.pdf?src-supplier=RSComponents; ComponentLink2Description: https://datasheet.ciiva.com/11748/0900766b800bd7d2-11748707.pdf?src-supplier=RSComponents; ComponentLink3URL: https://datasheet.ciiva.com/19462/883464-19462371.pdf?src-supplier=Jameco; ComponentLink3Description: https://datasheet.ciiva.com/19462/883464-19462371.pdf?src-supplier=Jameco; ComponentLink4URL: https://datasheet.ciiva.com/30194/128550430450612-pcb-headers-30194512.pdf?src-supplier=Onlinecomponents.com; ComponentLink4Description: https://datasheet.ciiva.com/30194/128550430450612-pcb-headers-30194512.pdf?src-supplier=Onlinecomponents.com; ComponentLink5URL: https://datasheet.ciiva.com/9468/0430450612-pcb-headers-9468492.pdf?src-supplier=Avnet; ComponentLink5Description: https://datasheet.ciiva.com/9468/0430450612-pcb-headers-9468492.pdf?src-supplier=Avnet; Supplier Part Number 1: 2332898
R*#1 R*#2 = R10k-VTR: Trimmer, Cermet, Rest 10 Kilohms, PCB, 25 Turns, Pwr-Rtg 0.5W, 3296 Series; Manufacturer: Bourns; Tolerance: 10%; Power Rating: 500mW; Number of Turns: 25; Temperature Coefficient: 100ppm/°C; Insulation Resistance: 1GR; .Creator: DO; Supplier 1: RSComponents; Manufacturer Part Number: 3296W-1-103LF; RoHS: Yes; Category: Variable Resistors and Potentiometers; Stock 1: 3300; Pricing 1: 50=2,54800, 100=2,31900, 200=2,14000, 300=1,88400, 500=1,55300 (USD); Mount: PCB,Through Hole; Weight: 0.03oz; Color: Blue; Contact Plating: Tin,Matte; Min Operating Temperature: -55°C; Max Operating Temperature: 125°C; Packaging: Rail/Tube; Package Quantity: 50; Termination: Pin; Resistor Type: Cermet; Technology: CERMET; Taper: Linear; Max Power Dissipation: 500mW; Series: 3296; Resistance Tolerance: 10%; Length: 9.53mm; Width: 9.53mm; Height: 0.395inch; Depth: 4.83mm; Radiation Hardening: No; REACH SVHC: No SVHC; Military Standard: Not; Lead Free: Lead Free; RoHS Compliant: Yes; ComponentLink1URL: https://datasheet.ciiva.com/19454/853572-19454866.pdf?src-supplier=Jameco; ComponentLink1Description: https://datasheet.ciiva.com/19454/853572-19454866.pdf?src-supplier=Jameco; ComponentLink2URL: https://datasheet.ciiva.com/11830/0900766b8069ccf4-11830871.pdf?src-supplier=RSComponents; ComponentLink2Description: https://datasheet.ciiva.com/11830/0900766b8069ccf4-11830871.pdf?src-supplier=RSComponents; ComponentLink3URL: https://datasheet.ciiva.com/29122/447277-da-01-en-trimmer-tht3296w-1-103lf-10k-0-5w-29122362.pdf?src-supplier=Conrad; ComponentLink3Description: https://datasheet.ciiva.com/29122/447277-da-01-en-trimmer-tht3296w-1-103lf-10k-0-5w-29122362.pdf?src-supplier=Conrad; ComponentLink4URL: https://datasheet.ciiva.com/26913/3296w-1-103lf-26913885.pdf?src-supplier=IIIC; ComponentLink4Description: https://datasheet.ciiva.com/26913/3296w-1-103lf-26913885.pdf?src-supplier=IIIC; ComponentLink5URL: https://datasheet.ciiva.com/1131/1815117-1131273.pdf?src-supplier=Element14; ComponentLink5Description: https://datasheet.ciiva.com/1131/1815117-1131273.pdf?src-supplier=Element14; ComponentLink6URL: https://datasheet.ciiva.com/18411/70153578-18411561.pdf?src-supplier=Allied+Electronics; ComponentLink6Description: https://datasheet.ciiva.com/18411/70153578-18411561.pdf?src-supplier=Allied+Electronics; ComponentLink7URL: https://datasheet.ciiva.com/3266/3296-3266187.pdf?src-supplier=Avnet; ComponentLink7Description: https://datasheet.ciiva.com/3266/3296-3266187.pdf?src-supplier=Avnet; ComponentLink8URL: https://datasheet.ciiva.com/30093/3296-30093899.pdf?src-supplier=Onlinecomponents.com; ComponentLink8Description: https://datasheet.ciiva.com/30093/3296-30093899.pdf?src-supplier=Onlinecomponents.com; ComponentLink9URL: https://datasheet.ciiva.com/2156/3296-2156893.pdf?src-supplier=Digi-Key; ComponentLink9Description: https://datasheet.ciiva.com/2156/3296-2156893.pdf?src-supplier=Digi-Key; ComponentLink10URL: https://datasheet.ciiva.com/14173/ew3296-dat-e-14173022.pdf?src-supplier=Distrelec; ComponentLink10Description: https://datasheet.ciiva.com/14173/ew3296-dat-e-14173022.pdf?src-supplier=Distrelec; Supplier Part Number 1: 1673377; ComponentLink11Description: Where buy it; ComponentLink11URL: https://es.rs-online.com/web/p/potenciometros-de-ajuste/5219647

## Sheet TS.SchDoc
size A4; SheetNumber: 5; SheetTotal: 5
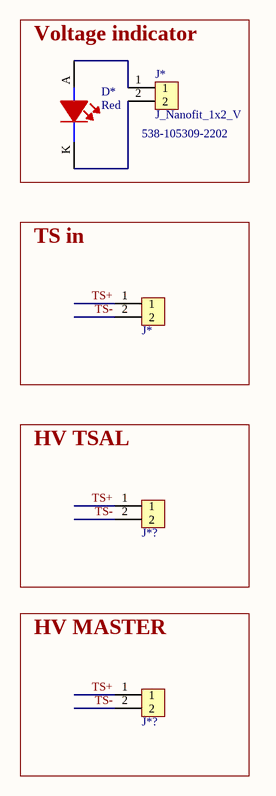
[diagram p4: TS.SchDoc]

### Parts
(Parts that share a designator on the sheet are numbered #1, #2 ... from top to bottom, then left to right.)
D*  Color: Red  [LED-THT/WE/D3.9H10.5]  (hidden comment: 150080RS75000)
J*#12  J_Nanofit_1x2_V  Supplier Part Number 1: 538-105309-2202  [J_NanoFit_1X2_V]
J*#13  436500215  [J_MicroFit_2x1]  (value not drawn)
J*?#15  436500215  [J_MicroFit_2x1]  (value not drawn)
J*?#16  436500215  [J_MicroFit_2x1]  (value not drawn)

### Blocks framed on the sheet
Voltage indicator: D* J*#12
TS in: J*#13
HV TSAL: J*?#15
HV MASTER: J*?#16

### Nets
TS+: J*#13.1 J*?#15.1 J*?#16.1
TS-: J*#13.2 J*?#15.2 J*?#16.2
NetD*_A: D*.A J*#12.1
NetD*_K: D*.K J*#12.2

### Library data of the parts
D* = LEDRS-THT: 0805(H=0.8mm) 红色 高亮 λD=625nm VF=2V IF=30mA PD=72mW; Manufacturer 1: Wurth Electronics; Luminous Intensity: 150mcd; Viewing Angle: 140°; Forward Voltage: 2V; Wavelength: 625nm; Lens Style: Clear,Rectangular; Forward Current: 30mA; Test Current: 20mA; .Creator: DR; ComponentLink1Description: Datasheet; ComponentLink1URL: https://www.we-online.com/catalog/datasheet/150080RS75000.pdf; ComponentLink2Description: Where buy it; ComponentLink2URL: https://katalog.we-online.de/en/led/WL-SMCW/150080RS75000; Supplier 1: RSComponents; Manufacturer Part Number 1: 150080RS75000; RoHS: Yes; Category: LEDs; Stock 1: 1; Pricing 1: 50=0,19300, 500=0,12900, 1000=0,12300, 2000=0,11700, 4000=0,11100 (USD); Mount: Surface Mount; Case/Package: 0805; Case Code (Metric): 2012; Case Code (Imperial): 0805; Min Operating Temperature: -40°C; Max Operating Temperature: 85°C; Package Quantity: 4000; Packaging: Tape and Reel; Dominant Wavelength: 625nm; Length: 2mm; Width: 1.25mm; Height: 0.7mm; REACH SVHC: Unknown; RoHS Compliant: Yes; ComponentLink3URL: https://datasheet.ciiva.com/22656/150080rs75000-22656961.pdf?src-supplier=Element14; ComponentLink3Description: https://datasheet.ciiva.com/22656/150080rs75000-22656961.pdf?src-supplier=Element14; ComponentLink4URL: https://datasheet.ciiva.com/29279/759435-da-01-en-chipled-0805-w-kl-rot-150080rs75000-29279032.pdf?src-supplier=Conrad; ComponentLink4Description: https://datasheet.ciiva.com/29279/759435-da-01-en-chipled-0805-w-kl-rot-150080rs75000-29279032.pdf?src-supplier=Conrad; Supplier Part Number 1: 8154225P
J*#12 = J_Nanofit_1x2_V: as J*#3 on sheet Master; Supplier 1: Mouser; RoHS: No; Stock 1: 6299; Pricing 1: 1=1,09, 10=0,839, 50=0,839, 100=0,686, 1000=0,571, 10000=0,507 (USD)
J*#13 J*?#15 J*?#16 = J_MicroFit_2x1: as J?#18 on sheet Master; Supplier 1: Arrow Electronics; RoHS: Yes; Category: Headers and Wire Housings; Stock 1: 11086; Pricing 1: 1=0,87800, 10=0,74400, 80=0,63070, 3264=0,47000, 6528=0,45100, 13056=0,41760 (USD); ComponentLink1URL: https://datasheet.ciiva.com/19462/884109-19462034.pdf?src-supplier=Jameco; ComponentLink1Description: https://datasheet.ciiva.com/19462/884109-19462034.pdf?src-supplier=Jameco; ComponentLink2URL: https://datasheet.ciiva.com/5157/0436500215-pcb-headers-148687-5157608.pdf?src-supplier=Mouser; ComponentLink2Description: https://datasheet.ciiva.com/5157/0436500215-pcb-headers-148687-5157608.pdf?src-supplier=Mouser; ComponentLink3URL: https://datasheet.ciiva.com/16085/0436500215-pcb-headers-16085668.pdf?src-supplier=Onlinecomponents.com; ComponentLink3Description: https://datasheet.ciiva.com/16085/0436500215-pcb-headers-16085668.pdf?src-supplier=Onlinecomponents.com; ComponentLink4URL: https://datasheet.ciiva.com/11748/0900766b80307ce2-11748388.pdf?src-supplier=RSComponents; ComponentLink4Description: https://datasheet.ciiva.com/11748/0900766b80307ce2-11748388.pdf?src-supplier=RSComponents; ComponentLink5URL: https://datasheet.ciiva.com/9432/0436500215-pcb-headers-9432850.pdf?src-supplier=Avnet; ComponentLink5Description: https://datasheet.ciiva.com/9432/0436500215-pcb-headers-9432850.pdf?src-supplier=Avnet; ComponentLink6URL: https://datasheet.ciiva.com/7920/1889390-7920892.pdf?src-supplier=Element14; ComponentLink6Description: https://datasheet.ciiva.com/7920/1889390-7920892.pdf?src-supplier=Element14; Supplier Part Number 1: 43650-0215

## Nets that join several sheets
+12: Master (J?#19.3 J?#20.3 R*?.2), Extras (R*#1.2 R*#2.2)
+24: Testbench__PCB (J*#1.1), Master (J*#2.1 J?#14.1 J?#17.1 J?#18.1), Extras (14 pins)
GND: Testbench__PCB (J*#1.4), ECUs (J?#1.4 J?#2.4 J?#3.4), Master (7 pins), Extras (21 pins)
CAN1_H: Master (J?#19.1 J?#20.1), Extras (12 pins)
CAN1_L: Master (J?#19.2 J?#20.2), Extras (12 pins)
SC_END: Master (6 pins), Extras (J*#9.1 J*?#9.1 J?#21.4)